# Altium project MainBoard.PrjPcb
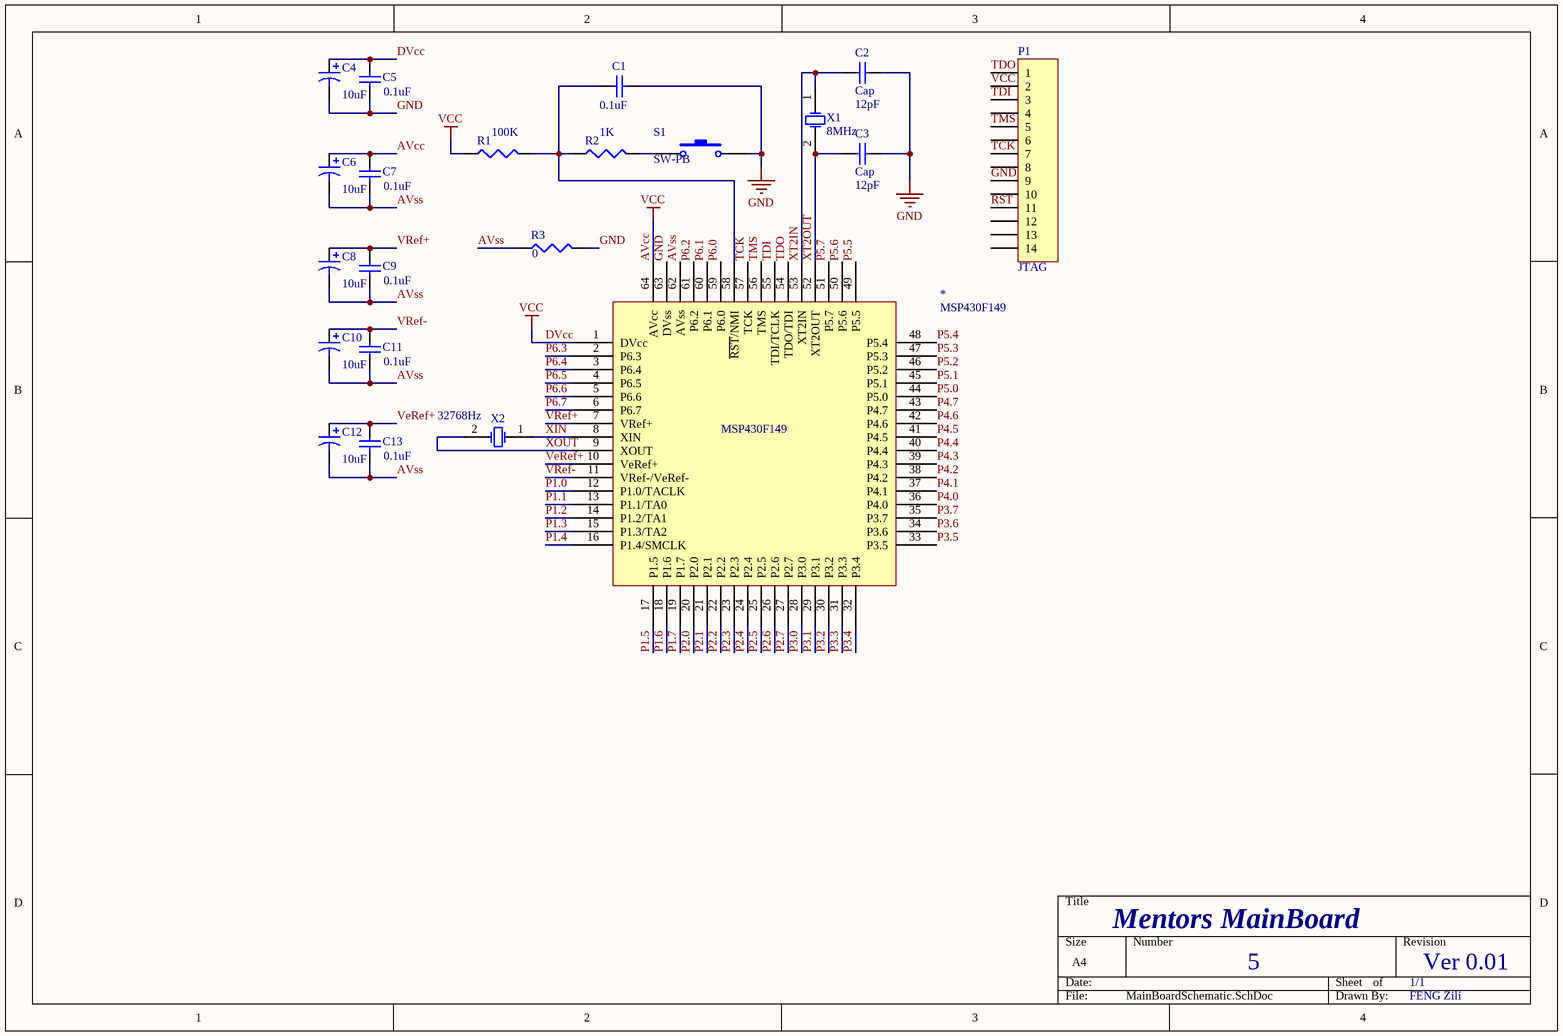
[diagram p0: MainBoardSchematic.SchDoc]
1 sheet, 21 parts. Net scope: global (net labels, ports and power ports of the same name join across sheets).
Board file: MainBoardPCB.PcbDoc

## Sheet MainBoardSchematic.SchDoc
size A4

### Parts
*  MSP430F149
C1  value 0.1uF  [RAD-0.3]  (hidden comment: Cap)
C2  Cap  value 12pF  [RAD-0.3]
C3  Cap  value 12pF  [RAD-0.3]
C4  value 10uF  [C0805]  (hidden comment: Cap Pol3)
C5  value 0.1uF  [RAD-0.3]  (hidden comment: Cap)
C6  value 10uF  [C0805]  (hidden comment: Cap Pol3)
C7  value 0.1uF  [RAD-0.3]  (hidden comment: Cap)
C8  value 10uF  [C0805]  (hidden comment: Cap Pol3)
C9  value 0.1uF  [RAD-0.3]  (hidden comment: Cap)
C10  value 10uF  [C0805]  (hidden comment: Cap Pol3)
C11  value 0.1uF  [RAD-0.3]  (hidden comment: Cap)
C12  value 10uF  [C0805]  (hidden comment: Cap Pol3)
C13  value 0.1uF  [RAD-0.3]  (hidden comment: Cap)
P1  JTAG  [HDR1X14]
R1  value 100K  [J1-0603]  (hidden comment: Res3)
R2  value 1K  [J1-0603]
R3  value 0  [J1-0603]
S1  SW-PB  [SPST-2]
X1  8MHz  [R38]
X2  32768Hz  [R38]

### Nets
AVcc: *.1(DVcc) *.64(AVcc) C4.1 C5.2 C6.1 C7.2 P1.2 R1.1  [also labelled DVcc, VCC]
GND: *.63(DVss) C1.2 C2.1 C3.1 C4.2 C5.1 P1.9 R3.2 S1.2
AVss: *.62(AVss) C6.2 C7.1 C8.2 C9.1 C10.2 C11.1 C12.2 C13.1 R3.1
P1.0: *.12(P1.0/TACLK)
P1.1: *.13(P1.1/TA0)
P1.2: *.14(P1.2/TA1)
P1.3: *.15(P1.3/TA2)
P1.4: *.16(P1.4/SMCLK)
P1.5: *.17(P1.5)
P1.6: *.18(P1.6)
P1.7: *.19(P1.7)
P2.0: *.20(P2.0)
P2.1: *.21(P2.1)
P2.2: *.22(P2.2)
P2.3: *.23(P2.3)
P2.4: *.24(P2.4)
P2.5: *.25(P2.5)
P2.6: *.26(P2.6)
P2.7: *.27(P2.7)
P3.0: *.28(P3.0)
P3.1: *.29(P3.1)
P3.2: *.30(P3.2)
P3.3: *.31(P3.3)
P3.4: *.32(P3.4)
P3.5: *.33(P3.5)
P3.6: *.34(P3.6)
P3.7: *.35(P3.7)
P4.0: *.36(P4.0)
P4.1: *.37(P4.1)
P4.2: *.38(P4.2)
P4.3: *.39(P4.3)
P4.4: *.40(P4.4)
P4.5: *.41(P4.5)
P4.6: *.42(P4.6)
P4.7: *.43(P4.7)
P5.0: *.44(P5.0)
P5.1: *.45(P5.1)
P5.2: *.46(P5.2)
P5.3: *.47(P5.3)
P5.4: *.48(P5.4)
P5.5: *.49(P5.5)
P5.6: *.50(P5.6)
P5.7: *.51(P5.7)
P6.0: *.59(P6.0)
P6.1: *.60(P6.1)
P6.2: *.61(P6.2)
P6.3: *.2(P6.3)
P6.4: *.3(P6.4)
P6.5: *.4(P6.5)
P6.6: *.5(P6.6)
P6.7: *.6(P6.7)
RST: P1.11
TCK: *.57(TCK) P1.7
TDI: *.55(TDI/TCLK) P1.3
TDO: *.54(TDO/TDI) P1.1
TMS: *.56(TMS) P1.5
VeRef+: *.10(VeRef+) C12.1 C13.2
VRef+: *.7(VRef+) C8.1 C9.2
VRef-: *.11(VRef-/VeRef-) C10.1 C11.2
XIN: *.8(XIN) X2.1(OSC1)
XOUT: *.9(XOUT) X2.2(OSC2)
XT2IN: *.53(XT2IN) C2.2 X1.1(OSC1)
XT2OUT: *.52(XT2OUT) C3.2 X1.2(OSC2)
Net*_58: *.58(~{RST}/NMI) C1.1 R1.2 R2.1
NetR2_2: R2.2 S1.1

Not connected (* = marked no-connect by the designer): P1 4 6 8 10 12 13 14

### Notes on the sheet
- Mentors MainBoard
- 5
- 1/1
- Ver 0.01
- FENG Zili

### Library data of the parts
C1-C3 C5 C7 C9 C11 C13 = Cap: Capacitor; Published: 8-Jun-2000; LatestRevisionDate: 17-Jul-2002; LatestRevisionNote: Re-released for DXP Platform.; PackageReference: RAD-0.3; Publisher: Altium Limited; PackageDescription: Radial Cap, Thru-Hole; 2 Leads; 0.3 in Pin Spacing
C4 C6 C8 C10 C12 = Cap Pol3: Polarized Capacitor (Surface Mount); Published: 8-Jun-2000; LatestRevisionDate: 29-May-2009; LatestRevisionNote: IPC-7351 Footprint Added.; PackageReference: C0805; Publisher: Altium Limited; PackageDescription: Chip Capacitor
P1 = Header 14: Header, 14-Pin; LatestRevisionDate: 17-Jul-2002; LatestRevisionNote: Re-released for DXP Platform.; Publisher: Altium Limited
R1-R3 = Res3: Resistor; Published: 8-Jun-2000; LatestRevisionDate: 29-May-2009; LatestRevisionNote: IPC-7351 Footprint Added.; PackageReference: J1-0603; Publisher: Altium Limited; PackageDescription: Chip Resistor
S1 = SW-PB: Switch; Published: 24-Mar-1999; LatestRevisionDate: 17-Jul-2002; LatestRevisionNote: Re-released for DXP Platform.; PackageReference: SPST-2; Publisher: Altium Limited; PackageDescription: Switch; 2 Leads
X1 X2 = XTAL: Crystal Oscillator; Published: 8-Jun-2000; LatestRevisionDate: 17-Jul-2002; LatestRevisionNote: Re-released for DXP Platform.; PackageReference: R38; Publisher: Altium Limited; PackageDescription: Crystal, Thru-Hole; 2 Leads; Body 3.1 x 8.2 mm (Dia.xH)